# Altium schematic sheet Connectors.SchDoc: Connectors
size Letter; DocumentNumber: 3; SheetNumber: 3; SheetTotal: 4
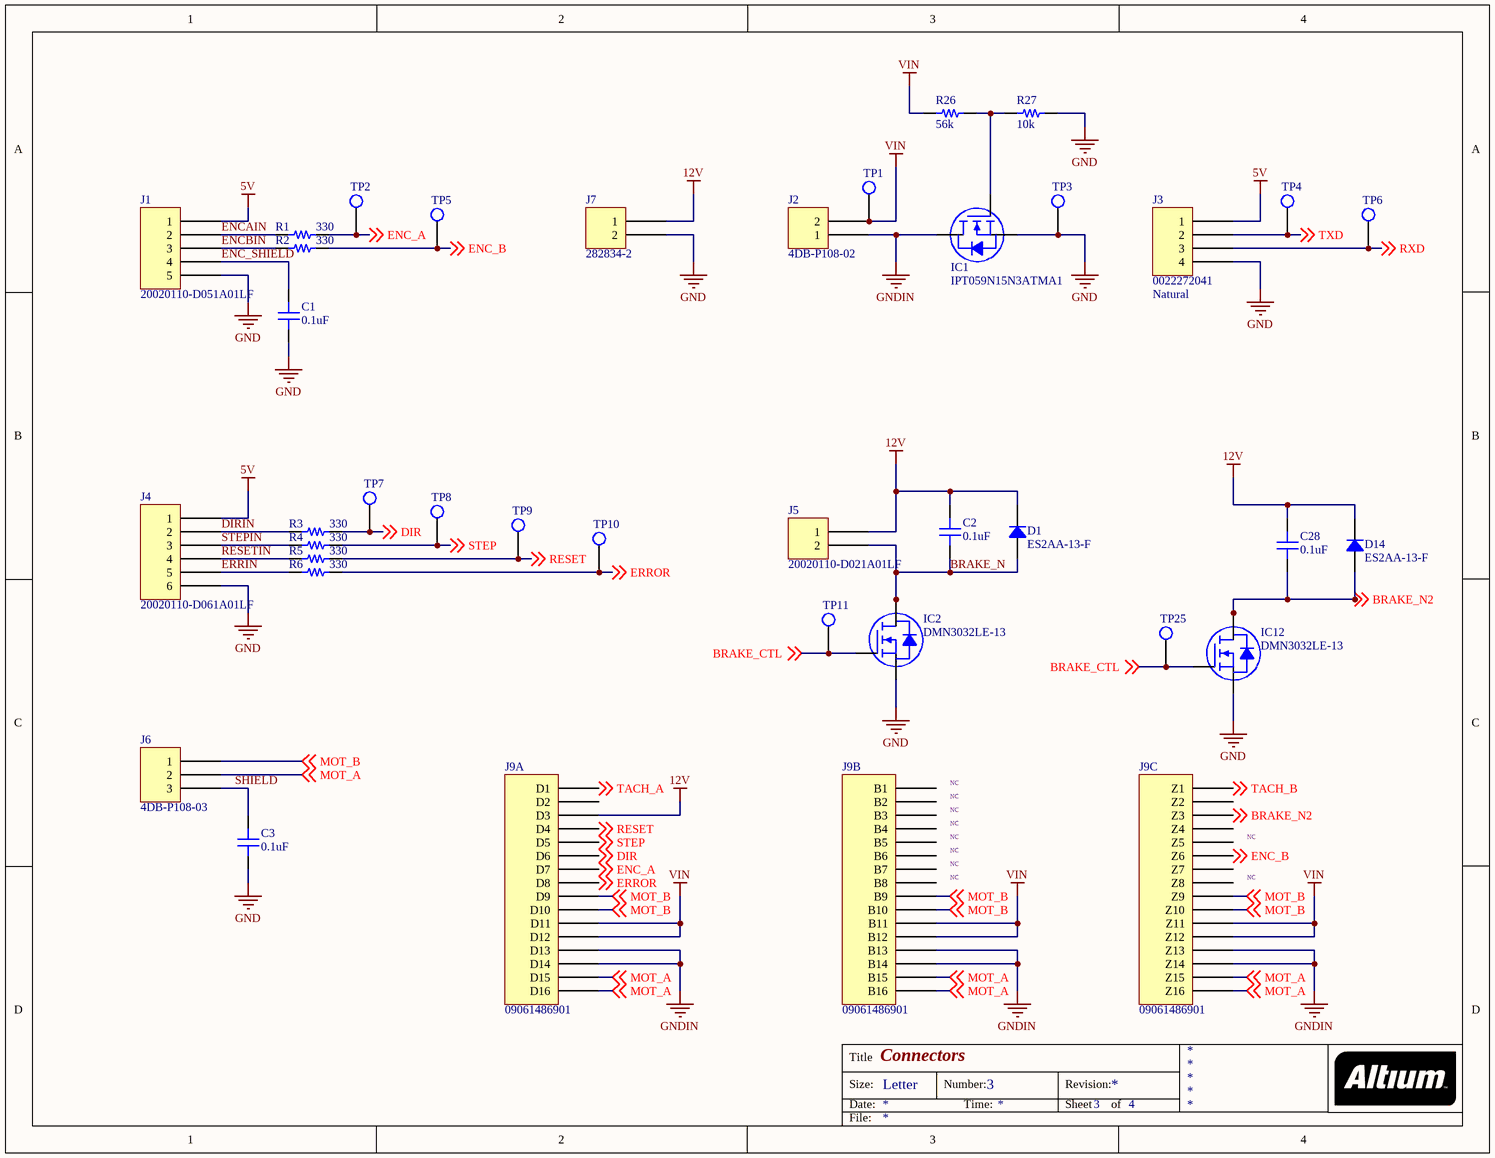
[diagram p0: Connectors.SchDoc]

## Parts
C1  0.1uF  [CAP 0805/2012]
C2  0.1uF  [CAP 0805/2012]
C3  0.1uF  [CAP 0805/2012]
C28  0.1uF  [CAP 0805/2012]
D1  ES2AA-13-F  [DO214AC SMA]
D14  ES2AA-13-F  [DO214AC SMA]
IC1  IPT059N15N3ATMA1  [INFINEON PG-HSOF-8-1]
IC2  DMN3032LE-13  [DIODES SOT-223]
IC12  DMN3032LE-13  [DIODES SOT-223]
J1  20020110-D051A01LF  [FCI 06-381-5PIN]
J2  4DB-P108-02  [TE 4DB-P108-02]
J3  0022272041  Colour: Natural  [MOLEX KK 0022272041]
J4  20020110-D061A01LF  [FCI 06-381-6PIN]
J5  20020110-D021A01LF  [FCI 06-381-2PIN]
J6  4DB-P108-03  [TE 4DB-P108-03]
J7  282834-2  [TE 282834-2]
J9  09061486901  [HARTING 09061486901]  (parts A,B,C of 3)
R1  330  [RES 0603/1608]
R2  330  [RES 0603/1608]
R3  330  [RES 0603/1608]
R4  330  [RES 0603/1608]
R5  330  [RES 0603/1608]
R6  330  [RES 0603/1608]
R26  56k  [RES 0603/1608]
R27  10k  [RES 0603/1608]
TP1  Test Point  [Test Point]  (value not drawn)  (no BOM)
TP2  Test Point  [Test Point]  (value not drawn)  (no BOM)
TP3  Test Point  [Test Point]  (value not drawn)  (no BOM)
TP4  Test Point  [Test Point]  (value not drawn)  (no BOM)
TP5  Test Point  [Test Point]  (value not drawn)  (no BOM)
TP6  Test Point  [Test Point]  (value not drawn)  (no BOM)
TP7  Test Point  [Test Point]  (value not drawn)  (no BOM)
TP8  Test Point  [Test Point]  (value not drawn)  (no BOM)
TP9  Test Point  [Test Point]  (value not drawn)  (no BOM)
TP10  Test Point  [Test Point]  (value not drawn)  (no BOM)
TP11  Test Point  [Test Point]  (value not drawn)  (no BOM)
TP25  Test Point  [Test Point]  (value not drawn)  (no BOM)

## Nets
5V: J1.1 J3.1 J4.1
12V: C2.2 C28.2 D1.2 D14.2 J5.1 J7.1 J9.D3
GND: C1.1 C3.1 IC1.S IC2.3(S) IC12.3(S) J1.5 J3.4 J4.6 J7.2 R27.2 TP3.1(TP)
GNDIN: IC1.D J2.1 J9.B13 J9.B14 J9.D13 J9.D14 J9.Z13 J9.Z14
VIN: J2.2 J9.B11 J9.B12 J9.D11 J9.D12 J9.Z11 J9.Z12 R26.1 TP1.1(TP)
BRAKE_CTL: IC2.1(G) IC12.1(G) TP11.1(TP) TP25.1(TP) ; off-sheet BRAKE_CTL
BRAKE_N: C2.1 D1.1 IC2.2(D) IC2.4(D) J5.2
BRAKE_N2: C28.1 D14.1 IC12.2(D) IC12.4(D) J9.Z3 ; off-sheet BRAKE_N2
DIR: J9.D6 R3.2 TP7.1(TP) ; off-sheet DIR
DIRIN: J4.2 R3.1
ENC_A: J9.D7 R1.2 TP2.1(TP) ; off-sheet ENC_A
ENC_B: J9.Z6 R2.2 TP5.1(TP) ; off-sheet ENC_B
ENC_SHIELD: C1.2 J1.4
ENCAIN: J1.2 R1.1
ENCBIN: J1.3 R2.1
ERRIN: J4.5 R6.1
ERROR: J9.D8 R6.2 TP10.1(TP) ; off-sheet ERROR
MOT_A: J6.2 J9.B15 J9.B16 J9.D15 J9.D16 J9.Z15 J9.Z16 ; off-sheet MOT_A
MOT_B: J6.1 J9.B9 J9.B10 J9.D9 J9.D10 J9.Z9 J9.Z10 ; off-sheet MOT_B
RESET: J9.D4 R5.2 TP9.1(TP) ; off-sheet RESET
RESETIN: J4.4 R5.1
RXD: J3.3 TP6.1(TP) ; off-sheet RXD
SHIELD: C3.2 J6.3
STEP: J9.D5 R4.2 TP8.1(TP) ; off-sheet STEP
STEPIN: J4.3 R4.1
TACH_A: J9.D1 ; off-sheet TACH_A
TACH_B: J9.Z1 ; off-sheet TACH_B
TXD: J3.2 TP4.1(TP) ; off-sheet TXD
NetIC1_G: IC1.G R26.2 R27.1

Not connected (* = marked no-connect by the designer): J9 B1 B2 B3 B4 B5 B6 B7 B8 D2 Z2 Z4 Z5 Z7 Z8

## Notes on the sheet
- NC
- Title
- Size:
- Date:
- Letter
- Number:
- Time:
- Revision:
- Sheet
- of
- File:

## Library data of the parts
C1-C3 C28 = C2012X5R2A104K125AA: CAP CER 0.1UF 100V X5R 0805; Manufacturer: TDK Corporation; TemperatureRange: -55C ~ 85C; Tolerance: 10%; Value: 0.1uF; Part Number: C2012X5R2A104K125AA; PartId: 4491; Supplier 1: Digi-Key; Supplier Part Number 1: 445-14435-2-ND; ComponentLink1Description: Datasheet; ComponentLink1URL: https://product.tdk.com/info/en/catalog/datasheets/mlcc_commercial_midvoltage_en.pdf; ComponentLink2Description: Digi-Key listing; ComponentLink2URL: http://digikey.com/product-detail/en/C2012X5R2A104K125AA/445-14435-2-ND/3951671; TemperatureCoefficient: X5R; Voltage: 100V; Price: 0.0473; Type: -; Device Package: 0805 (2012 Metric)
D1 D14 = ES2AA-13-F: DIODE GEN PURP 50V 2A SMA; Manufacturer: Diodes Incorporated; Type: Standard; Current Reverse Leakage @ Vr: 5uA @ 50V; Reverse Recovery Time (trr): 25ns; Voltage Forward (Vf): 920mV @ 2A; Part Number: ES2AA-13-F; PartId: 16339; Supplier 1: Digi-Key; Supplier Part Number 1: ES2AA-FDITR-ND; ComponentLink1Description: Datasheet; ComponentLink1URL: http://www.diodes.com/_files/datasheets/ds14002.pdf; ComponentLink2Description: Digi-Key Listing; ComponentLink2URL: https://www.digikey.com/product-detail/en/diodes-incorporated/ES2AA-13-F/ES2AA-FDITR-ND/765412; Junction Operating Temperature: -55C ~ 150C; Price: 0.124; Device Package: DO-214AC, SMA; Voltage DC Reverse (Vr): 50V; Current Rectified: 2A
IC1 = IPT059N15N3ATMA1: MOSFET N-CH 150V 155A 8HSOF; Manufacturer: Infineon Technologies; Rds On (Max) at Id, Vgs: 5.9 mOhm @ 150A, 10V; Vgs(th) (Max) at Id: 4V @ 270uA; Current Continuous Drain: 155A (Tc); Part Number: IPT059N15N3ATMA1; PartId: 21207; Supplier 1: Digi-Key; Supplier Part Number 1: IPT059N15N3ATMA1CT-ND; ComponentLink1Description: Datasheet; ComponentLink1URL: http://www.infineon.com/dgdl/IPT059N15N3+G_Rev1.1.pdf?folderId=db3a304326623792012669f6bee2224b&fileId=db3a30433e9d5d11013e9e62778d0185; ComponentLink2Description: Digi-Key Listing; ComponentLink2URL: http://www.digikey.ca/product-detail/en/infineon-technologies/IPT059N15N3ATMA1/IPT059N15N3ATMA1CT-ND/4571880; Price: 9.27; Type: N-Channel; Device Package: 8-PowerSFN; Drain to Source Voltage (Vdss): 150V; Features: -
IC2 IC12 = DMN3032LE-13: MOSFET N-CH 30V 5.6A SOT223; Manufacturer: Diodes Incorporated; Rds On (Max) at Id, Vgs: 29 mOhm @ 3.2A, 10V; Vgs(th) (Max) at Id: 2V @ 250uA; Gate Charge (Qg): 11.3nC @ 10V; Input Capacitance (Ciss) at Vds: 498pF @ 15V; Power - Max: 1.8W; Current Continuous Drain: 5.6A (Ta); Part Number: DMN3032LE-13; PartId: 8090; Supplier 1: Digi-Key; Supplier Part Number 1: DMN3032LE-13DITR-ND; ComponentLink1Description: Datasheet; ComponentLink1URL: http://diodes.com/_files/datasheets/DMN3032LE.pdf; ComponentLink2Description: Digi-Key Listing; ComponentLink2URL: http://www.digikey.com/product-detail/en/DMN3032LE-13/DMN3032LE-13DITR-ND/4747642; Price: 0.1937; Type: MOSFET N-Channel, Metal Oxide; Device Package: TO-261-4, TO-261AA; Drain to Source Voltage (Vdss): 30V; Features: Standard
J1 = 20020110-D051A01LF: TERM BLOCK HDR 5POS R/A 3.81MM; Manufacturer: FCI; TemperatureRange: -40C ~ 115C; Voltage: 300V; Pitch: 0.150" (3.81mm); Number Of Positions: 5; Number Of Levels: 1; Part Number: 20020110-D051A01LF; PartId: 7788; Supplier 1: Digi-Key; Supplier Part Number 1: 609-3822-ND; ComponentLink1Description: Datasheet; ComponentLink1URL: http://portal.fciconnect.com/Comergent//fci/drawing/20020110.pdf; ComponentLink2Description: Digi-Key Listing; ComponentLink2URL: http://www.digikey.ca/product-detail/en/20020110-D051A01LF/609-3822-ND/2261276; Price: 1.33; Type: Through Hole; Colour: Green; Orientation: 90, Right Angle; Positions Per Level: 5
J2 = 4DB-P108-02: CONN BARRIER STRIP 2CIRC 0.325"; Manufacturer: TE Connectivity AMP Connectors; Number Of Circuits: 2; Pitch: 0.325" (8.26mm); Current Rating: 20A; Voltage: 150V; Wire Gauge: 12-22 AWG; Top Termination: Screws with Captive Plate; Bottom Termination: PC Pin; Barrier Type: 2 Wall (Dual); Part Number: 4DB-P108-02; PartId: 27456; Supplier 1: Digi-Key; Supplier Part Number 1: A98472-ND; Supplier 2: Digi-Key; Supplier Part Number 2: A98472-ND; Supplier 3: Digi-Key; Supplier Part Number 3: A98472-ND; Supplier 4: Digi-Key; Supplier Part Number 4: A98472-ND; ComponentLink1Description: Datasheet; ComponentLink1URL: http://www.te.com/commerce/DocumentDelivery/DDEController?Action=srchrtrv&DocNm=2-1437667-4&DocType=Customer+Drawing&DocLang=English; ComponentLink2Description: Digi-Key Listing; ComponentLink2URL: http://www.digikey.com/product-detail/en/te-connectivity-amp-connectors/4DB-P108-02/A98472-ND/1277921; Price: 0.99; Type: Barrier Block; Series: 4DB, Buchanan; Part Status: Active; Number Of Wire Entries: 2; Number Of Rows: 1; Features: -; Colour: Black; Terminal Screw Material: Steel; Terminal Screw Finish: Zinc, Clear Chromate; Mounting Type: Through Hole; Operating Temperature: 105C
J3 = 0022272041: CONN HEADER 4POS .100 VERT TIN; Manufacturer: Molex, LLC; Pitch: 0.100" (2.54mm); Number Of Positions: 4; Part Number: 0022272041; PartId: 9721; Supplier 1: Digi-Key; Supplier Part Number 1: WM4113-ND; ComponentLink1Description: Datasheet; ComponentLink1URL: http://www.molex.com/pdm_docs/sd/022272041_sd.pdf; ComponentLink2Description: Digi-Key Listing; ComponentLink2URL: http://www.digikey.com/product-search/en?keywords=22-27-2041; Price: 0.39; Type: Header, Unshrouded; Contact Finish: Tin; Fastening Type: Friction Lock; Number Of Rows: 1; Series: KK 6410
J4 = 20020110-D061A01LF: TERM BLOCK HDR 6POS R/A 3.81MM; Manufacturer: FCI; TemperatureRange: -40C ~ 115C; Voltage: 300V; Pitch: 0.150" (3.81mm); Number Of Positions: 6; Number Of Levels: 1; Part Number: 20020110-D061A01LF; PartId: 7789; Supplier 1: Digi-Key; Supplier Part Number 1: 609-3823-ND; ComponentLink1Description: Datasheet; ComponentLink1URL: http://portal.fciconnect.com/Comergent//fci/drawing/20020110.pdf; ComponentLink2Description: Digi-Key Listing; ComponentLink2URL: http://www.digikey.ca/product-detail/en/20020110-D061A01LF/609-3823-ND/2261282; Price: 1.61; Type: Through Hole; Colour: Green; Orientation: 90, Right Angle; Positions Per Level: 6
J5 = 20020110-D021A01LF: TERM BLOCK HDR 2POS R/A 3.81MM; Manufacturer: FCI; TemperatureRange: -40C ~ 115C; Voltage: 300V; Pitch: 0.150" (3.81mm); Number Of Positions: 2; Number Of Levels: 1; Part Number: 20020110-D021A01LF; PartId: 7785; Supplier 1: Digi-Key; Supplier Part Number 1: 609-3819-ND; ComponentLink1Description: Datasheet; ComponentLink1URL: http://portal.fciconnect.com/Comergent//fci/drawing/20020110.pdf; ComponentLink2Description: Digi-Key Listing; ComponentLink2URL: http://www.digikey.ca/product-detail/en/20020110-D021A01LF/609-3819-ND/2261255; Price: 0.75; Type: Through Hole; Colour: Green; Orientation: 90, Right Angle; Positions Per Level: 2
J6 = 4DB-P108-03: CONN BARRIER STRIP 3CIRC 0.325"; Manufacturer: TE Connectivity AMP Connectors; Number Of Circuits: 3; Pitch: 0.325" (8.26mm); Current Rating: 20A; Voltage: 150V; Wire Gauge: 12-22 AWG; Top Termination: Screws with Captive Plate; Bottom Termination: PC Pin; Barrier Type: 2 Wall (Dual); Part Number: 4DB-P108-03; PartId: 27457; Supplier 1: Digi-Key; Supplier Part Number 1: A98473-ND; Supplier 2: Digi-Key; Supplier Part Number 2: A98473-ND; Supplier 3: Digi-Key; Supplier Part Number 3: A98473-ND; Supplier 4: Digi-Key; Supplier Part Number 4: A98473-ND; ComponentLink1Description: Datasheet; ComponentLink1URL: http://www.te.com/commerce/DocumentDelivery/DDEController?Action=srchrtrv&DocNm=2-1437667-4&DocType=Customer+Drawing&DocLang=English; ComponentLink2Description: Digi-Key Listing; ComponentLink2URL: http://www.digikey.com/products/en?keywords=4DB-P108-03; Price: 1.13; Type: Barrier Block; Series: 4DB, Buchanan; Part Status: Active; Number Of Wire Entries: 3; Number Of Rows: 1; Features: -; Colour: Black; Terminal Screw Material: Steel; Terminal Screw Finish: Zinc, Clear Chromate; Mounting Type: Through Hole; Operating Temperature: 105C
J7 = 282834-2: TERM BLOCK 2POS SIDE ENT 2.54MM; Manufacturer: TE Connectivity AMP Connectors; TemperatureRange: -40C ~ 105C; Voltage: 150V; Pitch: 0.100" (2.54mm); Number Of Levels: 1; Positions Per Level: 2; Part Number: 282834-2; PartId: 9289; Supplier 1: Digi-Key; Supplier Part Number 1: A98333-ND; ComponentLink1Description: Datasheet; ComponentLink1URL: http://www.te.com/commerce/DocumentDelivery/DDEController?Action=srchrtrv&DocNm=282834&DocType=Customer+Drawing&DocLang=English; ComponentLink2Description: Digi-Key Listing; ComponentLink2URL: http://www.digikey.ca/product-detail/en/282834-2/A98333-ND/1150135; Price: 1.3; Colour: Green; Orientation: Horizontal with Board
J9 = 09061486901: DIN-POWER F048MS-3,0C1-2; Manufacturer: Harting; Number Of Positions: 48 (Power); Pitch: 0.200" (5.08mm); Style: F; Part Number: 09061486901; PartId: 27910; Supplier 1: Digi-Key; Supplier Part Number 1: 1195-1306-ND; ComponentLink1Description: Datasheet; ComponentLink1URL: https://b2b.harting.com/files/download/PRD/PDF_TS/0906148X901_100180101DRW107A.PDF; ComponentLink2Description: Digi-Key Listing; ComponentLink2URL: http://www.digikey.com/product-detail/en/harting/09061486901/1195-1306-ND/3179889; Operating Temperature: -; Price: 6.34; Type: Header, Male Pins; Part Status: Active; Series: DIN 41612; Number Of Rows: 3; Mounting Type: Through Hole, Right Angle; Termination: Solder; Features: -; Contact Finish: -
R1-R6 = ERJ-3GEYJ331V: RES SMD 330 OHM 5% 1/10W 0603; Manufacturer: Panasonic Electronic Components; TemperatureRange: -55C ~ 155C; TemperatureCoefficient: 200ppm/C; PowerRating: 0.1W, 1/10W; Value: 330; Part Number: ERJ-3GEYJ331V; PartId: 11189; Supplier 1: Digi-Key; Supplier Part Number 1: P330GTR-ND; ComponentLink1Description: Datasheet; ComponentLink1URL: http://industrial.panasonic.com/www-cgi/jvcr13pz.cgi?E+PZ+3+AOA0001+ERJ3GEYJ331V+7+WW; ComponentLink2Description: Digi-Key Listing; ComponentLink2URL: https://www.digikey.com/product-detail/en/panasonic-electronic-components/ERJ-3GEYJ331V/P330GTR-ND/135755; Tolerance: 5%; Price: 0.002; Device Package: 0603 (1608 Metric)
R26 = ERJ-3EKF5602V: RES SMD 56K OHM 1% 1/10W 0603; Manufacturer: Panasonic Electronic Components; TemperatureRange: -55C ~ 155C; TemperatureCoefficient: 100ppm/C; PowerRating: 0.1W, 1/10W; Value: 56k; Part Number: ERJ-3EKF5602V; PartId: 937; Supplier 1: Digi-Key; Supplier Part Number 1: P56.0KHTR-ND; ComponentLink1Description: Datasheet; ComponentLink1URL: http://industrial.panasonic.com/www-cgi/jvcr13pz.cgi?E+PZ+3+AOA0002+ERJ3EKF5602V+7+WW; ComponentLink2Description: Digi-Key listing; ComponentLink2URL: http://digikey.com/product-detail/en/ERJ-3EKF5602V/P56.0KHTR-ND/1746436; Tolerance: 1%; Price: 0.0038; Type: Thick Film; Device Package: 0603 (1608 Metric)
R27 = ERJ-3EKF1002V: RES SMD 10K OHM 1% 1/10W 0603; Manufacturer: Panasonic Electronic Components; TemperatureRange: -55C ~ 155C; TemperatureCoefficient: 100ppm/C; PowerRating: 0.1W, 1/10W; Value: 10k; Part Number: ERJ-3EKF1002V; PartId: 886; Supplier 1: Digi-Key; Supplier Part Number 1: P10.0KHTR-ND; ComponentLink1Description: Datasheet; ComponentLink1URL: http://industrial.panasonic.com/www-cgi/jvcr13pz.cgi?E+PZ+3+AOA0002+ERJ3EKF1002V+7+WW; ComponentLink2Description: Digi-Key listing; ComponentLink2URL: http://digikey.com/product-detail/en/ERJ-3EKF1002V/P10.0KHTR-ND/196066; Tolerance: 1%; Price: 0.0038; Type: Thick Film; Device Package: 0603 (1608 Metric)